# EAGLE design PixArt-Wii_3V3 (EAGLE 6.3)
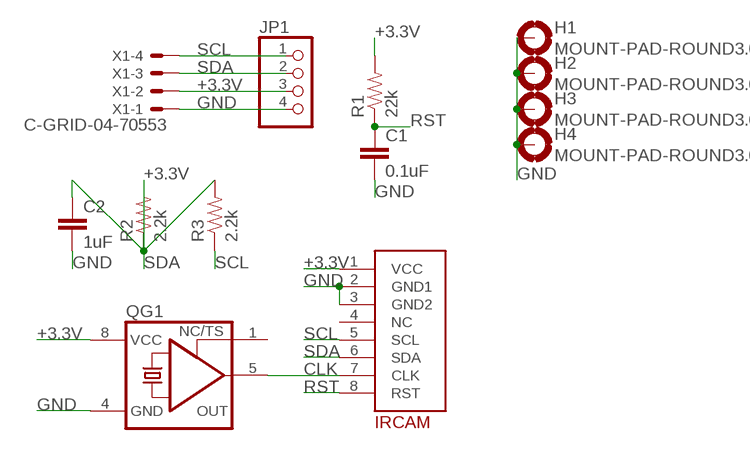
[diagram p0: schematic, sheet 1]

## Parts
C1  0.1uF  CAP1206  [1206]
C2  1uF  CAP1206  [1206]
H1  MOUNT-PAD-ROUND3.0  [3,0-PAD]
H2  MOUNT-PAD-ROUND3.0  [3,0-PAD]
H3  MOUNT-PAD-ROUND3.0  [3,0-PAD]
H4  MOUNT-PAD-ROUND3.0  [3,0-PAD]
IRCAM  PIXART_WII  [PIXART_WII]
JP1  PINHD-1X4  [1X04]
QG1  XO-8  [DIL08S]
R1  22k  RESISTOR1206  [1206]
R2  2.2k  RESISTOR1206  [1206]
R3  2.2k  RESISTOR1206  [1206]
X1  C-GRID-04-70553  [70553-04]

## Nets
+3.3V: C2.1 IRCAM.1(VCC) JP1.3 QG1.8(VCC) R1.2 R2.1 R3.2 X1.2
CLK: IRCAM.7(CLK) QG1.5(OUT)
GND: C1.2 C2.2 H1.B3,0(MOUNT) H2.B3,0(MOUNT) H3.B3,0(MOUNT) H4.B3,0(MOUNT) IRCAM.2(GND1) IRCAM.3(GND2) JP1.4 QG1.4(GND) X1.1
RST: C1.1 IRCAM.8(RST) R1.1
SCL: IRCAM.5(SCL) JP1.1 R3.1 X1.4
SDA: IRCAM.6(SDA) JP1.2 R2.2 X1.3
Unconnected: IRCAM.4(NC) QG1.1(TS)

## Library data of the parts
C1 = SparkFun:CAP: Capacitor Standard 0603 ceramic capacitor, and 0.1" leaded capacitor.
C2 = SparkFun-Passives:CAP: Capacitor Standard 0603 ceramic capacitor, and 0.1" leaded capacitor.
H1-H4 = holes:MOUNT-PAD-ROUND: MOUNTING PAD, round
IRCAM = nintendo:PIXART_WII: Custom footprint for Wii PixArt Sensor.
JP1 = pinhead:PINHD-1X4: PIN HEADER
QG1 = crystal:XO-: CRYSTAL; OC_FARNELL: unknown; OC_NEWARK: unknown
R1 = SparkFun:RESISTOR: Resistor Basic schematic elements and footprints for 0603, 1206, and PTH resistors.
R2 R3 = SparkFun-Passives:RESISTOR: Resistor Basic schematic elements and footprints for 0603, 1206, and PTH resistors.
X1 = con-molex:C-GRID-04: CONNECTOR wire to board 2.54 mm (0.100") pitch header; OC_FARNELL: unknown; OC_NEWARK: unknown

## Board
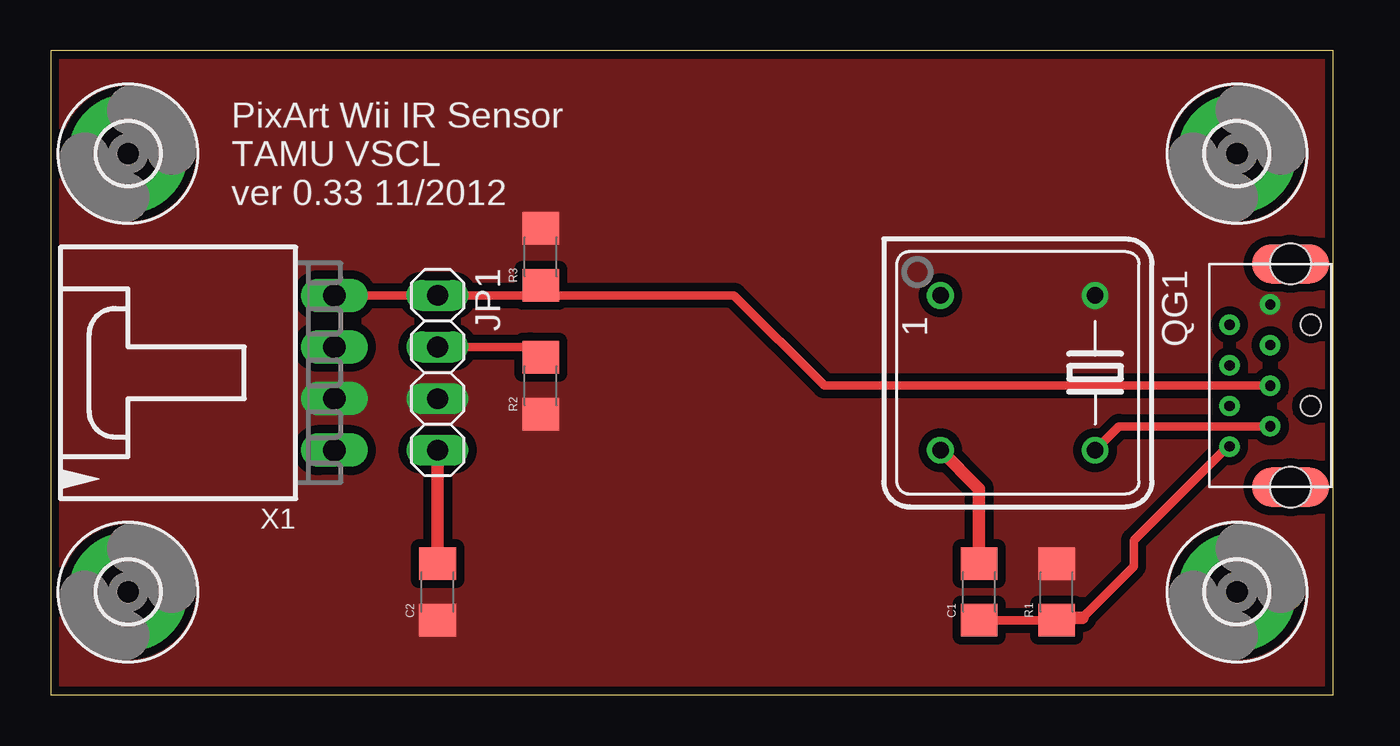
[diagram p1: board, top side]
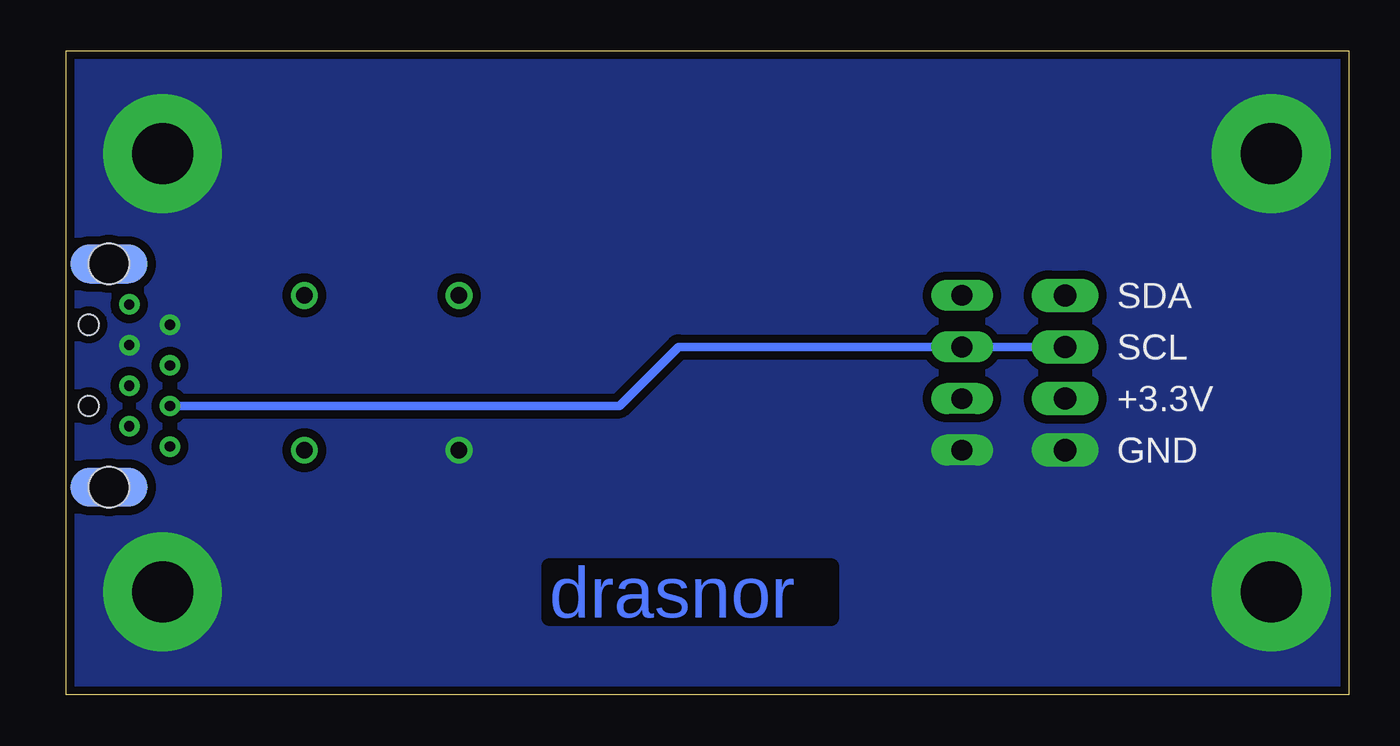
[diagram p2: board, bottom side, seen from below]

Size 63.17 x 31.74 mm. Coordinates in mm from the lower left corner, seen from the top.
Outline: 0,0 63.17,0 63.17,31.74 0,31.74 0,0
Copper layers (1*16): Top 0.0356mm / dielectric 63mil / Bottom 0.0356mm
Design rules "advanced *": minimum track width 6mil, minimum drill 15mil, track to track 6mil, track to pad 6mil, pad to pad 6mil, via to via 6mil, smd to smd 6mil, copper to edge 6mil, drill to drill 6mil, minimum pad ring 10mil, minimum via ring 8mil, stop-mask expansion 4mil, vias tented up to drill 0mil, thermal gap 10mil

### Footprints (pad centres in the part's own frame; a part is rotated, then mirrored left to right if it is on the bottom)
1206 = smd 1.6 x 1.8: 1 -1.4,0; 2 1.4,0
3,0-PAD = drill 3 pad 5.842: B3,0 0,0
PIXART_WII = drill 0.5: 1 -0.27,3.365; 2 -2.27,2.365; 3 -0.27,1.365; 4 -2.27,0.365; 5 -0.27,-0.635; 6 -2.27,-1.635; 7 -0.27,-2.635; 8 -2.27,-3.635 | smd 3.81 x 1.93: P$9 0.73,-5.635; P$10 0.73,5.365 | smd 3.81 x 1.93 bottom: P$11 0.73,5.365; P$12 0.73,-5.635 | hole 1: 1.73,2.365; 1.73,-1.635 | hole 2: 0.73,5.365; 0.73,-5.635
1X04 = drill 1.016 long: 1 -3.81,0; 2 -1.27,0; 3 1.27,0; 4 3.81,0
DIL08S = drill 0.813: 1 -3.81,-3.81; 4 3.81,-3.81; 5 3.81,3.81; 8 -3.81,3.81
70553-04 = drill 1.092 long: 1 -3.81,-7.62; 2 -1.27,-7.62; 3 1.27,-7.62; 4 3.81,-7.62

### Placement (x,y rotation side)
C1  45.72,5.08 90 top
C2  19.05,5.08 90 top
H1  58.42,5.08 0 top
H2  3.81,5.08 0 top
H3  3.81,26.67 0 top
H4  58.42,26.67 0 top
IRCAM  60.33,15.88 0 top
JP1  19.05,15.88 270 top
QG1  47.62,15.88 270 top
R1  49.53,5.08 90 top
R2  24.13,15.24 90 top
R3  24.13,21.59 90 top
X1  6.35,15.88 90 top

### Tracks (layer width: path | path; a pad name or v marks a point on that pad's centre or on a via)
+3.3V
  pour Top (isolate 0.406, no thermals): 0,31.75 63.5,31.75 63.5,0 0,0
CLK
  Top 0.406: QG1.5 52.61,13.24 IRCAM.7
GND
  Top 0.61: JP1.4 C2.2 | QG1.4 45.72,10.16 C1.2
  pour Bottom (isolate 0.406, no thermals): 0,31.75 63.5,31.75 63.5,0 0,0
RST
  Top 0.406: C1.1 R1.1 | 50.8,3.81 53.34,6.35 53.34,7.62 57.96,12.24
  Top 0.61: R1.1 49.66,3.81 50.8,3.81 | 57.96,12.24 IRCAM.8
SCL
  Top 0.406: X1.4 JP1.1 | JP1.1 23.62,19.68 | IRCAM.5 38.1,15.24 33.66,19.68 JP1.1
  Top 0.61: 23.62,19.68 R3.1
SDA
  Top 0.406: JP1.2 23.62,17.14
  Top 0.61: 23.62,17.14 R2.2
  Bottom 0.406: X1.3 JP1.2 33.02,17.14 35.92,14.24 IRCAM.6

### Text on the board
Bottom: drasnor
tNames: PixArt Wii IR Sensor / TAMU VSCL / ver 0.33 11/2012
bNames: SDA | SCL | +3.3V | GND